# Altium schematic sheet MCPS Power 030307.SchDoc
size A4
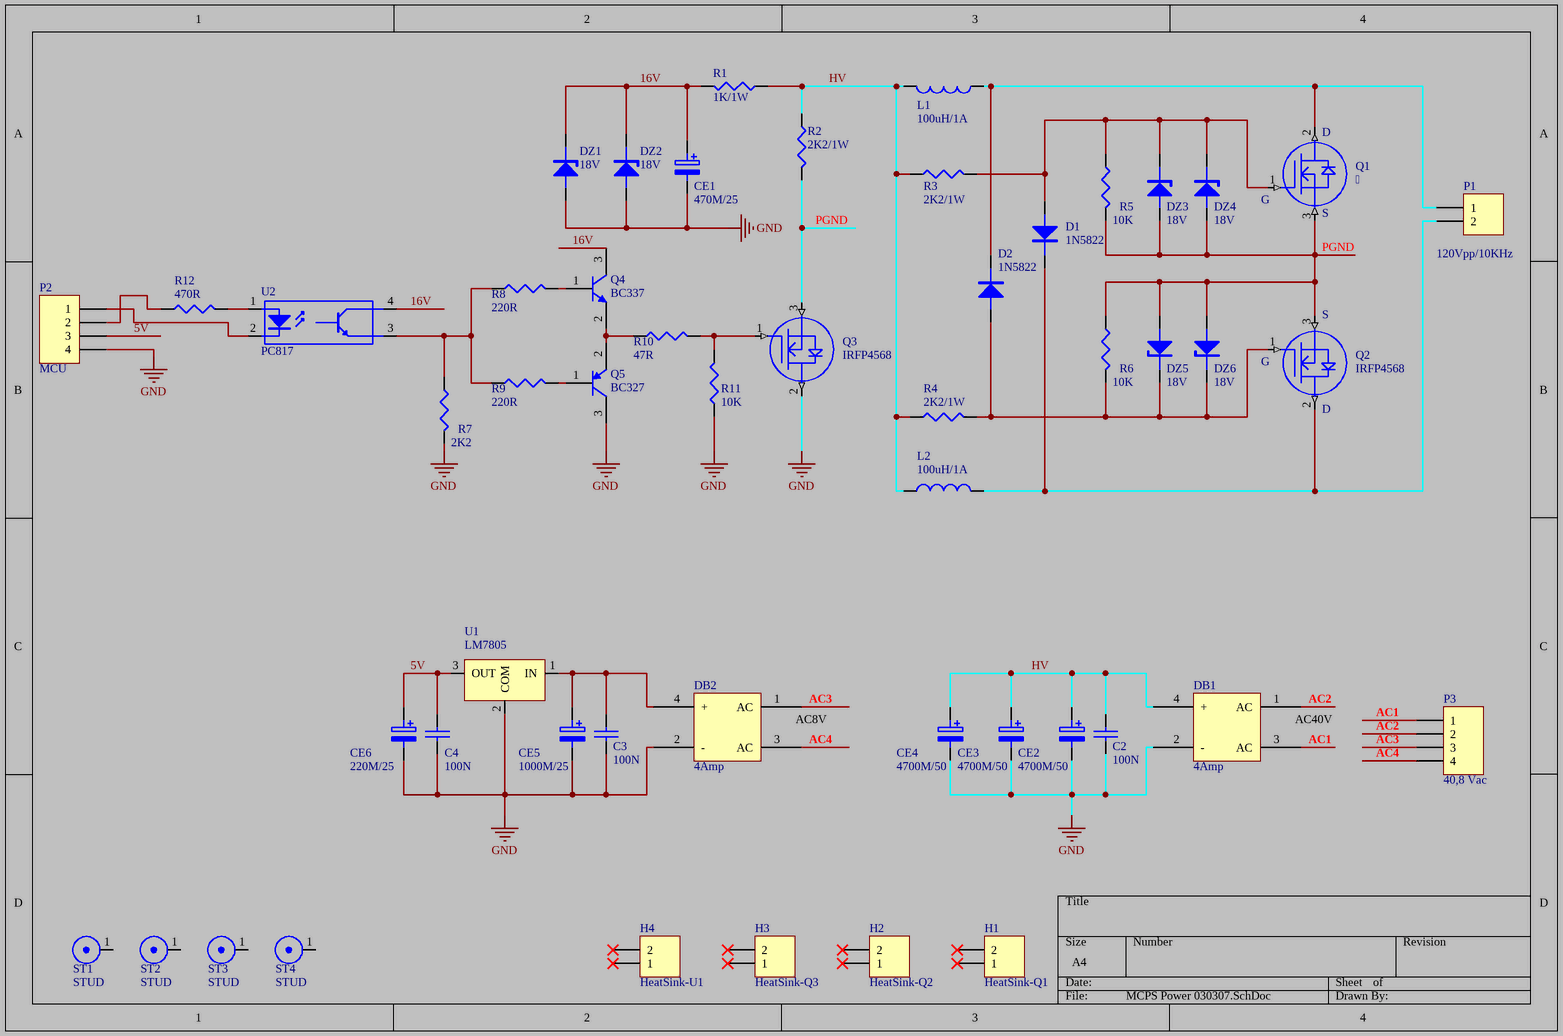
[diagram p0: MCPS Power 030307.SchDoc]

## Parts
C2  100N  [c2P]
C3  100N  [c2P]
C4  100N  [c2P]
CE1  470M/25  [cap2p12]
CE2  4700M/50  [CAP3P5]
CE3  4700M/50  [CAP3P5]
CE4  4700M/50  [CAP3P5]
CE5  1000M/25  [cap2p12]
CE6  220M/25  [cap2p12]
D1  1N5822  [D54]
D2  1N5822  [D54]
DB1  4Amp  [BRG GBU]
DB2  4Amp  [BRG F]
DZ1  18V  [D4P]
DZ2  18V  [D4P]
DZ3  18V  [D4P]
DZ4  18V  [D4P]
DZ5  18V  [D4P]
DZ6  18V  [D4P]
H1  HeatSink-Q1  [heatsink2]
H2  HeatSink-Q2  [heatsink2]
H3  HeatSink-Q3  [heatsink2]
H4  HeatSink-U1  [heatsink5]
L1  100uH/1A  [Inductor-Brown]
L2  100uH/1A  [Inductor-Brown]
P1  120Vpp/10KHz  [2EDG]
P2  MCU  [DSIP4]
P3  40,8 Vac  [4EDG]
Q1    [TO220T]
Q2  IRFP4568  [TO220T]
Q3  IRFP4568  [TO220T]
Q4  BC337  [CBE-BC546]
Q5  BC327  [CBE-BC546]
R1  1K/1W  [w1]
R2  2K2/1W  [w1]
R3  2K2/1W  [w1]
R4  2K2/1W  [w1]
R5  10K  [R5P]
R6  10K  [R5P]
R7  2K2  [R4P]
R8  220R  [R4P]
R9  220R  [R4P]
R10  47R  [R4P]
R11  10K  [R4P]
R12  470R  [R4P]
ST1  STUD  [CORNER]
ST2  STUD  [CORNER]
ST3  STUD  [CORNER]
ST4  STUD  [CORNER]
U1  LM7805  [TO220T]
U2  PC817  [DIP4]

## Nets
GND: C2.2 C3.2 C4.2 CE1.2 CE2.2 CE3.2 CE4.2 CE5.2 CE6.2 DB1.2(-) DB2.2(-) DZ1.1(A) DZ2.1(A) P2.4 Q3.2(D) Q5.3(C) R7.2 R11.1 U1.2(COM)
5V: C4.1 CE6.1 P2.3 U1.3(OUT)
16V: CE1.1 DZ1.2(K) DZ2.2(K) Q4.3(C) R1.2 U2.4(C)
AC1: DB1.3(AC) P3.1
AC2: DB1.1(AC) P3.2
AC3: DB2.1(AC) P3.3
AC4: DB2.3(AC) P3.4
HV: C2.1 CE2.1 CE3.1 CE4.1 DB1.4(+) L1.1 L2.1 R1.1 R2.1 R3.1 R4.1
PGND: DZ3.1(A) DZ4.1(A) DZ5.1(A) DZ6.1(A) Q1.3(S) Q2.3(S) Q3.3(S) R2.2 R5.2 R6.1
NetC3_1: C3.1 CE5.1 DB2.4(+) U1.1(IN)
NetD1_1: D1.1(A) DZ3.2(K) DZ4.2(K) Q1.1(G) R3.2 R5.1
NetD1_2: D1.2(K) L2.2 P1.2 Q2.2(D)
NetD2_1: D2.1(A) DZ5.2(K) DZ6.2(K) Q2.1(G) R4.2 R6.2
NetD2_2: D2.2(K) L1.2 P1.1 Q1.2(D)
NetP2_1: P2.1 U2.2(K)
NetP2_2: P2.2 R12.1
NetQ3_1: Q3.1(G) R10.2 R11.2
NetQ4_1: Q4.1(B) R8.2
NetQ4_2: Q4.2(E) Q5.2(B) R10.1
NetQ5_1: Q5.1(E) R9.2
NetR7_1: R7.1 R8.1 R9.1 U2.3(E)
NetR12_2: R12.2 U2.1(A)

Not connected (* = marked no-connect by the designer): H1 1* 2*; H2 1* 2*; H3 1* 2*; H4 1* 2*; ST1 1; ST2 1; ST3 1; ST4 1

## Notes on the sheet
- (near Q1) D
- (near Q1) G
- (near Q1) S
- (near Q2) G
- (near Q2) S
- (near Q2) D
- (near DB2) AC8V
- (near DB1) AC40V

## Library data of the parts
C2-C4 = C
CE1-CE6 = E
D1 D2 = D: D4P: *
DB1 DB2 = BRIDGE
DZ1-DZ6 = DZ
H1-H4 P1 = Header 2: Header, 2-Pin; LatestRevisionDate: 17-Jul-2002; LatestRevisionNote: Re-released for DXP Platform.; Publisher: Altium Limited
L1 L2 = INDUCTOR
P2 P3 = Header 4: Header, 4-Pin; LatestRevisionDate: 17-Jul-2002; LatestRevisionNote: Re-released for DXP Platform.; Publisher: Altium Limited
Q1-Q3 = MOSFET N
Q4 = BC546
Q5 = M6: PNP; Published: 8-Jun-2000; LatestRevisionDate: 15-Jan-2003; LatestRevisionNote: PCB Footprint 'BCY-W3/D4.7' replaced; DatasheetVersion: 1997; PackageVersion: Sep-1998; PackageReference: TO-92A; Publisher: Altium Limited; PackageDescription: TO, Flat Index; 3 In-Line, Axial Leads; Body Dia. 4.5mm; Leads 0.51 x 0.48 mm (max)
R1-R12 = R
U1 = Regulator: SMD
U2 = OPTODIP4